# Altium project 车载定位器设计.PrjPcb
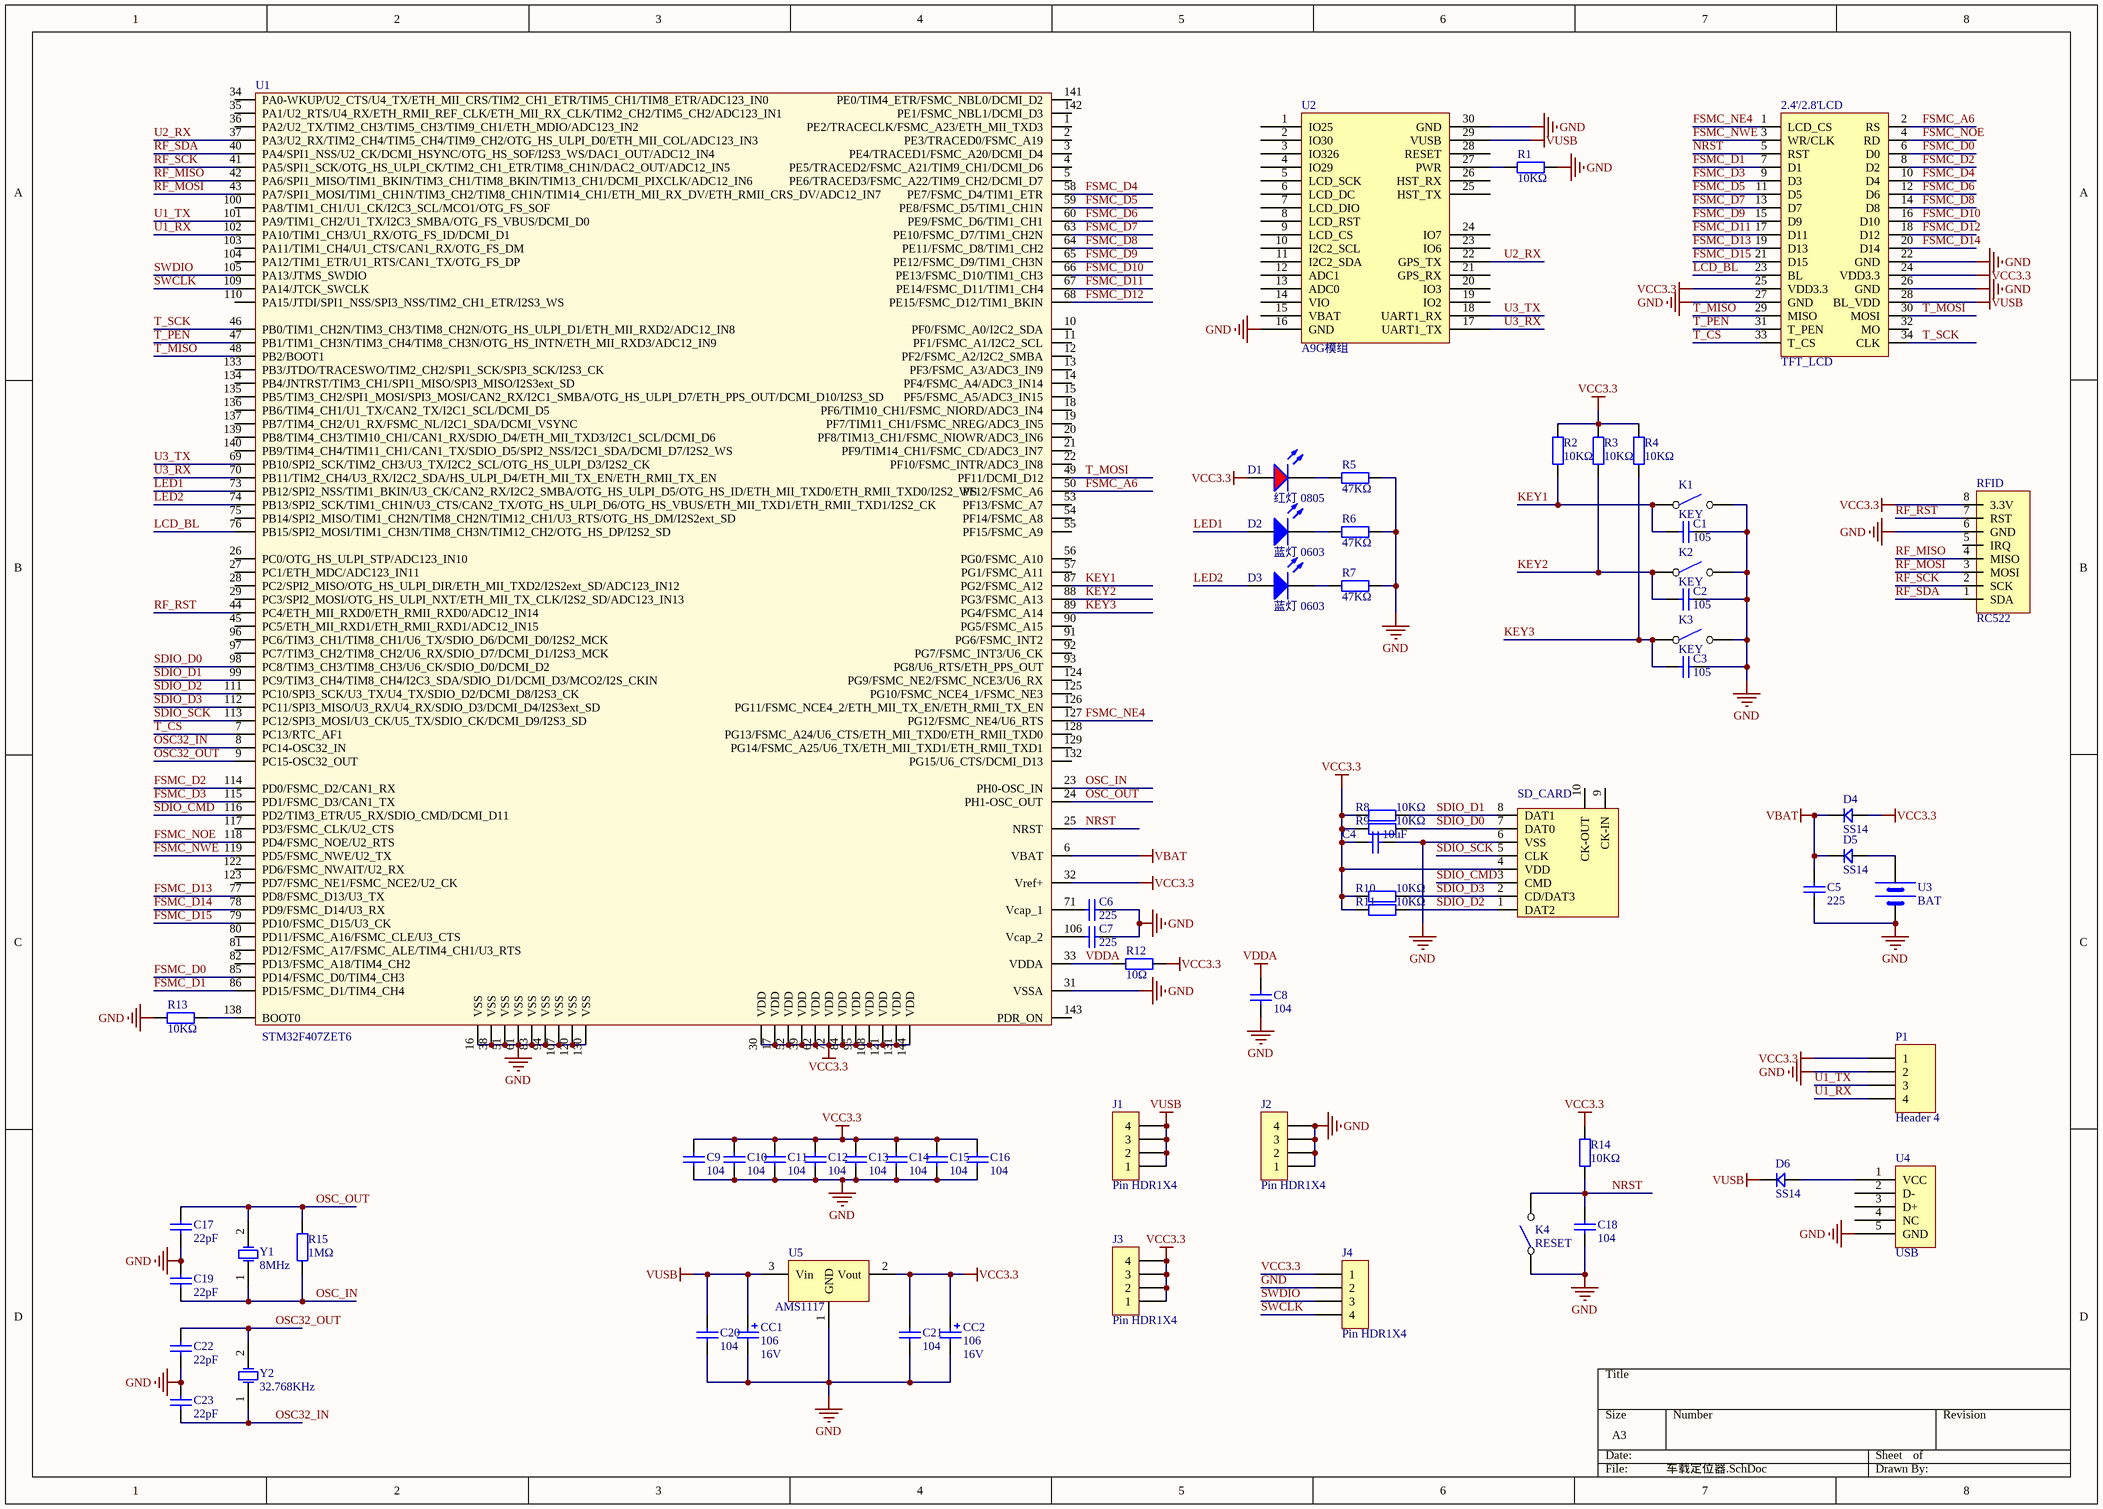
[diagram p0: 车载定位器.SchDoc]
1 sheet, 65 parts. Net scope: global (net labels, ports and power ports of the same name join across sheets).
Board file: 车载定位器.PcbDoc

## Sheet 车载定位器.SchDoc
size A3

### Parts
2.4'/2.8'LCD  TFT_LCD  [TFT_LCD2.8]
C1  105  [LC-0805_C]
C2  105  [LC-0805_C]
C3  105  [LC-0805_C]
C4  10uF  [LC-0805_C]
C5  225  [LC-0805_C]
C6  225  [LC-0805_C]
C7  225  [LC-0805_C]
C8  104  [LC-0805_C]
C9  104  [LC-0805_C]
C10  104  [LC-0805_C]
C11  104  [LC-0805_C]
C12  104  [LC-0805_C]
C13  104  [LC-0805_C]
C14  104  [LC-0805_C]
C15  104  [LC-0805_C]
C16  104  [LC-0805_C]
C17  22pF  [LC-0805_C]
C18  104  [LC-0805_C]
C19  22pF  [LC-0805_C]
C20  104  [LC-0805_C]
C21  104  [LC-0805_C]
C22  22pF  [LC-0805_C]
C23  22pF  [LC-0805_C]
CC1  Capacitance: 106  Voltage: 16V  [TAN-C-6032]  (hidden comment: Cap Tan C)
CC2  Capacitance: 106  Voltage: 16V  [TAN-C-6032]  (hidden comment: Cap Tan C)
D1  红灯 0805  [LC-0805_LED_S1]
D2  蓝灯 0603  [LC-0805_LED_S1]
D3  蓝灯 0603  [LC-0805_LED_S1]
D4  SS14  [LC-SOD-123]
D5  SS14  [LC-SOD-123]
D6  SS14  [LC-SOD-123]
J1  Pin HDR1X4  [Pin HDR1X4/2.54mm-S]
J2  Pin HDR1X4  [Pin HDR1X4/2.54mm-S]
J3  Pin HDR1X4  [Pin HDR1X4/2.54mm-S]
J4  Pin HDR1X4  [Pin HDR1X4/2.54mm-S]
K1  KEY  [KEY_2]
K2  KEY  [KEY_2]
K3  KEY  [KEY_2]
K4  RESET  [KEY_2]
P1  Header 4  [HDR1X4]
R1  10KΩ  [LC-0805_R]
R2  10KΩ  [LC-0805_R]
R3  10KΩ  [LC-0805_R]
R4  10KΩ  [LC-0805_R]
R5  47KΩ  [LC-0805_R]
R6  47KΩ  [LC-0805_R]
R7  47KΩ  [LC-0805_R]
R8  10KΩ  [LC-0805_R]
R9  10KΩ  [LC-0805_R]
R10  10KΩ  [LC-0805_R]
R11  10KΩ  [LC-0805_R]
R12  10Ω  [LC-0805_R]
R13  10KΩ  [LC-0805_R]
R14  10KΩ  [LC-0805_R]
R15  1MΩ  [LC-0805_R]
RFID  RC522  [RFID]
SD_CARD  sdIO-sdcard  [Micro SD]  (value not drawn)
U1  STM32F407ZET6  [LQFP144 20X20]
U2  A9G模组  [A9G]
U3  BAT  [CR1220_A]
U4  USB  [USB_B]
U5  AMS1117  [SOT-223]
Y1  8MHz  [XTAL-SMD]
Y2  32.768KHz  [OSC-3x8-WI-B]

### Nets
GND: 2.4'/2.8'LCD.22(GND) 2.4'/2.8'LCD.26(GND) 2.4'/2.8'LCD.27(GND) C1.2 C2.2 C3.2 C4.2 C5.1 C6.2 C7.2 C8.1 C9.1 C10.1 C11.1 C12.1 C13.1 C14.1 C15.1 C16.1 C17.1 C18.1 C19.2 C20.1 C21.1 C22.1 C23.2 CC1.1 CC2.1 J2.1 J2.2 J2.3 J2.4 J4.2 K1.2 K2.2 K3.2 K4.1 P1.2 R1.2 R5.2 R6.2 R7.2 R13.1 RFID.6(GND) SD_CARD.6(VSS) U1.16(VSS) U1.31(VSSA) U1.38(VSS) U1.51(VSS) U1.61(VSS) U1.83(VSS) U1.94(VSS) U1.107(VSS) U1.120(VSS) U1.130(VSS) U2.16(GND) U2.30(GND) U3.2(GND) U4.5(GND) U5.1(GND)
VBAT: C5.2 D4.2 D5.2 U1.6(VBAT)
VCC3.3: 2.4'/2.8'LCD.24(VDD3.3) 2.4'/2.8'LCD.25(VDD3.3) C4.1 C9.2 C10.2 C11.2 C12.2 C13.2 C14.2 C15.2 C16.2 C21.2 CC2.2 D1.A D4.1 J3.1 J3.2 J3.3 J3.4 J4.1 P1.1 R2.2 R3.2 R4.2 R8.1 R9.1 R10.1 R11.1 R12.2 R14.2 RFID.8(3.3V) SD_CARD.4(VDD) U1.17(VDD) U1.30(VDD) U1.32(Vref+) U1.39(VDD) U1.52(VDD) U1.62(VDD) U1.72(VDD) U1.84(VDD) U1.95(VDD) U1.108(VDD) U1.121(VDD) U1.131(VDD) U1.144(VDD) U5.2(Vout)
VDDA: C8.2 R12.1 U1.33(VDDA)
VUSB: 2.4'/2.8'LCD.28(BL_VDD) C20.2 CC1.2 D6.2 J1.1 J1.2 J1.3 J1.4 U2.29(VUSB) U5.3(Vin)
FSMC_A6: 2.4'/2.8'LCD.2(RS) U1.50(PF12/FSMC_A6)
FSMC_D0: 2.4'/2.8'LCD.6(D0) U1.85(PD14/FSMC_D0/TIM4_CH3)
FSMC_D1: 2.4'/2.8'LCD.7(D1) U1.86(PD15/FSMC_D1/TIM4_CH4)
FSMC_D2: 2.4'/2.8'LCD.8(D2) U1.114(PD0/FSMC_D2/CAN1_RX)
FSMC_D3: 2.4'/2.8'LCD.9(D3) U1.115(PD1/FSMC_D3/CAN1_TX)
FSMC_D4: 2.4'/2.8'LCD.10(D4) U1.58(PE7/FSMC_D4/TIM1_ETR)
FSMC_D5: 2.4'/2.8'LCD.11(D5) U1.59(PE8/FSMC_D5/TIM1_CH1N)
FSMC_D6: 2.4'/2.8'LCD.12(D6) U1.60(PE9/FSMC_D6/TIM1_CH1)
FSMC_D7: 2.4'/2.8'LCD.13(D7) U1.63(PE10/FSMC_D7/TIM1_CH2N)
FSMC_D8: 2.4'/2.8'LCD.14(D8) U1.64(PE11/FSMC_D8/TIM1_CH2)
FSMC_D9: 2.4'/2.8'LCD.15(D9) U1.65(PE12/FSMC_D9/TIM1_CH3N)
FSMC_D10: 2.4'/2.8'LCD.16(D10) U1.66(PE13/FSMC_D10/TIM1_CH3)
FSMC_D11: 2.4'/2.8'LCD.17(D11) U1.67(PE14/FSMC_D11/TIM1_CH4)
FSMC_D12: 2.4'/2.8'LCD.18(D12) U1.68(PE15/FSMC_D12/TIM1_BKIN)
FSMC_D13: 2.4'/2.8'LCD.19(D13) U1.77(PD8/FSMC_D13/U3_TX)
FSMC_D14: 2.4'/2.8'LCD.20(D14) U1.78(PD9/FSMC_D14/U3_RX)
FSMC_D15: 2.4'/2.8'LCD.21(D15) U1.79(PD10/FSMC_D15/U3_CK)
FSMC_NE4: 2.4'/2.8'LCD.1(LCD_CS) U1.127(PG12/FSMC_NE4/U6_RTS)
FSMC_NOE: 2.4'/2.8'LCD.4(RD) U1.118(PD4/FSMC_NOE/U2_RTS)
FSMC_NWE: 2.4'/2.8'LCD.3(WR/CLK) U1.119(PD5/FSMC_NWE/U2_TX)
KEY1: C1.1 K1.1 R2.1 U1.87(PG2/FSMC_A12)
KEY2: C2.1 K2.1 R3.1 U1.88(PG3/FSMC_A13)
KEY3: C3.1 K3.1 R4.1 U1.89(PG4/FSMC_A14)
LCD_BL: 2.4'/2.8'LCD.23(BL) U1.76(PB15/SPI2_MOSI/TIM1_CH3N/TIM8_CH3N/TIM12_CH2/OTG_HS_DP/I2S2_SD)
LED1: D2.A U1.73(PB12/SPI2_NSS/TIM1_BKIN/U3_CK/CAN2_RX/I2C2_SMBA/OTG_HS_ULPI_D5/OTG_HS_ID/ETH_MII_TXD0/ETH_RMII_TXD0/I2S2_WS)
LED2: D3.A U1.74(PB13/SPI2_SCK/TIM1_CH1N/U3_CTS/CAN2_TX/OTG_HS_ULPI_D6/OTG_HS_VBUS/ETH_MII_TXD1/ETH_RMII_TXD1/I2S2_CK)
NRST: 2.4'/2.8'LCD.5(RST) C18.2 K4.2 R14.1 U1.25(NRST)
OSC32_IN: C23.1 U1.8(PC14-OSC32_IN) Y2.1(OSC1)
OSC32_OUT: C22.2 U1.9(PC15-OSC32_OUT) Y2.2(OSC2)
OSC_IN: C19.1 R15.1 U1.23(PH0-OSC_IN) Y1.1(OSC1)
OSC_OUT: C17.2 R15.2 U1.24(PH1-OSC_OUT) Y1.2(OSC2)
RF_MISO: RFID.4(MISO) U1.42(PA6/SPI1_MISO/TIM1_BKIN/TIM3_CH1/TIM8_BKIN/TIM13_CH1/DCMI_PIXCLK/ADC12_IN6)
RF_MOSI: RFID.3(MOSI) U1.43(PA7/SPI1_MOSI/TIM1_CH1N/TIM3_CH2/TIM8_CH1N/TIM14_CH1/ETH_MII_RX_DV/ETH_RMII_CRS_DV/ADC12_IN7)
RF_RST: RFID.7(RST) U1.44(PC4/ETH_MII_RXD0/ETH_RMII_RXD0/ADC12_IN14)
RF_SCK: RFID.2(SCK) U1.41(PA5/SPI1_SCK/OTG_HS_ULPI_CK/TIM2_CH1_ETR/TIM8_CH1N/DAC2_OUT/ADC12_IN5)
RF_SDA: RFID.1(SDA) U1.40(PA4/SPI1_NSS/U2_CK/DCMI_HSYNC/OTG_HS_SOF/I2S3_WS/DAC1_OUT/ADC12_IN4)
SDIO_CMD: SD_CARD.3(CMD) U1.116(PD2/TIM3_ETR/U5_RX/SDIO_CMD/DCMI_D11)
SDIO_D0: R9.2 SD_CARD.7(DAT0) U1.98(PC8/TIM3_CH3/TIM8_CH3/U6_CK/SDIO_D0/DCMI_D2)
SDIO_D1: R8.2 SD_CARD.8(DAT1) U1.99(PC9/TIM3_CH4/TIM8_CH4/I2C3_SDA/SDIO_D1/DCMI_D3/MCO2/I2S_CKIN)
SDIO_D2: R11.2 SD_CARD.1(DAT2) U1.111(PC10/SPI3_SCK/U3_TX/U4_TX/SDIO_D2/DCMI_D8/I2S3_CK)
SDIO_D3: R10.2 SD_CARD.2(CD/DAT3) U1.112(PC11/SPI3_MISO/U3_RX/U4_RX/SDIO_D3/DCMI_D4/I2S3ext_SD)
SDIO_SCK: SD_CARD.5(CLK) U1.113(PC12/SPI3_MOSI/U3_CK/U5_TX/SDIO_CK/DCMI_D9/I2S3_SD)
SWCLK: J4.4 U1.109(PA14/JTCK_SWCLK)
SWDIO: J4.3 U1.105(PA13/JTMS_SWDIO)
T_CS: 2.4'/2.8'LCD.33(T_CS) U1.7(PC13/RTC_AF1)
T_MISO: 2.4'/2.8'LCD.29(MISO) U1.48(PB2/BOOT1)
T_MOSI: 2.4'/2.8'LCD.30(MOSI) U1.49(PF11/DCMI_D12)
T_PEN: 2.4'/2.8'LCD.31(T_PEN) U1.47(PB1/TIM1_CH3N/TIM3_CH4/TIM8_CH3N/OTG_HS_INTN/ETH_MII_RXD3/ADC12_IN9)
T_SCK: 2.4'/2.8'LCD.34(CLK) U1.46(PB0/TIM1_CH2N/TIM3_CH3/TIM8_CH2N/OTG_HS_ULPI_D1/ETH_MII_RXD2/ADC12_IN8)
U1_RX: P1.4 U1.102(PA10/TIM1_CH3/U1_RX/OTG_FS_ID/DCMI_D1)
U1_TX: P1.3 U1.101(PA9/TIM1_CH2/U1_TX/I2C3_SMBA/OTG_FS_VBUS/DCMI_D0)
U2_RX: U1.37(PA3/U2_RX/TIM2_CH4/TIM5_CH4/TIM9_CH2/OTG_HS_ULPI_D0/ETH_MII_COL/ADC123_IN3) U2.22(GPS_TX)
U3_RX: U1.70(PB11/TIM2_CH4/U3_RX/I2C2_SDA/HS_ULPI_D4/ETH_MII_TX_EN/ETH_RMII_TX_EN) U2.17(UART1_TX)
U3_TX: U1.69(PB10/SPI2_SCK/TIM2_CH3/U3_TX/I2C2_SCL/OTG_HS_ULPI_D3/I2S2_CK) U2.18(UART1_RX)
NetC6_1: C6.1 U1.71(Vcap_1)
NetC7_1: C7.1 U1.106(Vcap_2)
NetD1_K: D1.K R5.1
NetD2_K: D2.K R6.1
NetD3_K: D3.K R7.1
NetD5_1: D5.1 U3.1(VCC)
NetD6_1: D6.1 U4.1(VCC)
NetR1_1: R1.1 U2.27(PWR)
NetR13_2: R13.2 U1.138(BOOT0)

Not connected (* = marked no-connect by the designer): 2.4'/2.8'LCD 32(MO); RFID 5(IRQ); SD_CARD 9(CK-IN) 10(CK-OUT); U1 1(PE2/TRACECLK/FSMC_A23/ETH_MII_TXD3) 2(PE3/TRACED0/FSMC_A19) 3(PE4/TRACED1/FSMC_A20/DCMI_D4) 4(PE5/TRACED2/FSMC_A21/TIM9_CH1/DCMI_D6) 5(PE6/TRACED3/FSMC_A22/TIM9_CH2/DCMI_D7) 10(PF0/FSMC_A0/I2C2_SDA) 11(PF1/FSMC_A1/I2C2_SCL) 12(PF2/FSMC_A2/I2C2_SMBA) 13(PF3/FSMC_A3/ADC3_IN9) 14(PF4/FSMC_A4/ADC3_IN14) 15(PF5/FSMC_A5/ADC3_IN15) 18(PF6/TIM10_CH1/FSMC_NIORD/ADC3_IN4) 19(PF7/TIM11_CH1/FSMC_NREG/ADC3_IN5) 20(PF8/TIM13_CH1/FSMC_NIOWR/ADC3_IN6) 21(PF9/TIM14_CH1/FSMC_CD/ADC3_IN7) 22(PF10/FSMC_INTR/ADC3_IN8) 26(PC0/OTG_HS_ULPI_STP/ADC123_IN10) 27(PC1/ETH_MDC/ADC123_IN11) 28(PC2/SPI2_MISO/OTG_HS_ULPI_DIR/ETH_MII_TXD2/I2S2ext_SD/ADC123_IN12) 29(PC3/SPI2_MOSI/OTG_HS_ULPI_NXT/ETH_MII_TX_CLK/I2S2_SD/ADC123_IN13) 34(PA0-WKUP/U2_CTS/U4_TX/ETH_MII_CRS/TIM2_CH1_ETR/TIM5_CH1/TIM8_ETR/ADC123_IN0) 35(PA1/U2_RTS/U4_RX/ETH_RMII_REF_CLK/ETH_MII_RX_CLK/TIM2_CH2/TIM5_CH2/ADC123_IN1) 36(PA2/U2_TX/TIM2_CH3/TIM5_CH3/TIM9_CH1/ETH_MDIO/ADC123_IN2) 45(PC5/ETH_MII_RXD1/ETH_RMII_RXD1/ADC12_IN15) 53(PF13/FSMC_A7) 54(PF14/FSMC_A8) 55(PF15/FSMC_A9) 56(PG0/FSMC_A10) 57(PG1/FSMC_A11) 75(PB14/SPI2_MISO/TIM1_CH2N/TIM8_CH2N/TIM12_CH1/U3_RTS/OTG_HS_DM/I2S2ext_SD) 80(PD11/FSMC_A16/FSMC_CLE/U3_CTS) 81(PD12/FSMC_A17/FSMC_ALE/TIM4_CH1/U3_RTS) 82(PD13/FSMC_A18/TIM4_CH2) 90(PG5/FSMC_A15) 91(PG6/FSMC_INT2) 92(PG7/FSMC_INT3/U6_CK) 93(PG8/U6_RTS/ETH_PPS_OUT) 96(PC6/TIM3_CH1/TIM8_CH1/U6_TX/SDIO_D6/DCMI_D0/I2S2_MCK) 97(PC7/TIM3_CH2/TIM8_CH2/U6_RX/SDIO_D7/DCMI_D1/I2S3_MCK) 100(PA8/TIM1_CH1/U1_CK/I2C3_SCL/MCO1/OTG_FS_SOF) 103(PA11/TIM1_CH4/U1_CTS/CAN1_RX/OTG_FS_DM) 104(PA12/TIM1_ETR/U1_RTS/CAN1_TX/OTG_FS_DP) 110(PA15/JTDI/SPI1_NSS/SPI3_NSS/TIM2_CH1_ETR/I2S3_WS) 117(PD3/FSMC_CLK/U2_CTS) 122(PD6/FSMC_NWAIT/U2_RX) 123(PD7/FSMC_NE1/FSMC_NCE2/U2_CK) 124(PG9/FSMC_NE2/FSMC_NCE3/U6_RX) 125(PG10/FSMC_NCE4_1/FSMC_NE3) 126(PG11/FSMC_NCE4_2/ETH_MII_TX_EN/ETH_RMII_TX_EN) 128(PG13/FSMC_A24/U6_CTS/ETH_MII_TXD0/ETH_RMII_TXD0) 129(PG14/FSMC_A25/U6_TX/ETH_MII_TXD1/ETH_RMII_TXD1) 132(PG15/U6_CTS/DCMI_D13) 133(PB3/JTDO/TRACESWO/TIM2_CH2/SPI1_SCK/SPI3_SCK/I2S3_CK) 134(PB4/JNTRST/TIM3_CH1/SPI1_MISO/SPI3_MISO/I2S3ext_SD) 135(PB5/TIM3_CH2/SPI1_MOSI/SPI3_MOSI/CAN2_RX/I2C1_SMBA/OTG_HS_ULPI_D7/ETH_PPS_OUT/DCMI_D10/I2S3_SD) 136(PB6/TIM4_CH1/U1_TX/CAN2_TX/I2C1_SCL/DCMI_D5) 137(PB7/TIM4_CH2/U1_RX/FSMC_NL/I2C1_SDA/DCMI_VSYNC) 139(PB8/TIM4_CH3/TIM10_CH1/CAN1_RX/SDIO_D4/ETH_MII_TXD3/I2C1_SCL/DCMI_D6) 140(PB9/TIM4_CH4/TIM11_CH1/CAN1_TX/SDIO_D5/SPI2_NSS/I2C1_SDA/DCMI_D7/I2S2_WS) 141(PE0/TIM4_ETR/FSMC_NBL0/DCMI_D2) 142(PE1/FSMC_NBL1/DCMI_D3) 143(PDR_ON); U2 1(IO25) 2(IO30) 3(IO326) 4(IO29) 5(LCD_SCK) 6(LCD_DC) 7(LCD_DIO) 8(LCD_RST) 9(LCD_CS) 10(I2C2_SCL) 11(I2C2_SDA) 12(ADC1) 13(ADC0) 14(VIO) 15(VBAT) 19(IO2) 20(IO3) 21(GPS_RX) 23(IO6) 24(IO7) 25(HST_TX) 26(HST_RX) 28(RESET); U4 2(D-) 3(D+) 4(NC)

### Library data of the parts
C1-C3 C5-C7 C9-C16 C20 C21 = 0805 6.8nF (682) 10% 50V: 贴片电容; ComponentLink1Description: 供应商链接; ComponentLink1URL: http://www.szlcsc.com/product/details_2107.html; Package: 0805; Supplier: LC; SuppliersPartNumber: C1755
C4 = 0805 10uF (106) 10% 25V: 贴片电容; ComponentLink1Description: 供应商链接; ComponentLink1URL: http://www.szlcsc.com/product/details_16532.html; Package: 0805; Supplier: LC; SuppliersPartNumber: C15850
C8 C18 = 0805 330nF (334) 10% 50V: 贴片电容; ComponentLink1Description: 供应商链接; ComponentLink1URL: http://www.szlcsc.com/product/details_2092.html; Package: 0805; Supplier: LC; SuppliersPartNumber: C1740
C17 C19 C22 C23 = 0805 6pF (6R0) 0.25pF 50V: 贴片电容; ComponentLink1Description: 供应商链接; ComponentLink1URL: http://www.szlcsc.com/product/details_68656.html; Package: 0805; Supplier: LC; SuppliersPartNumber: C67560
CC1 CC2 = Cap Tan C: Polarized Capacitor (Radial); Published: 8-Jun-2000; Revision: July-2002: Re-released for DXP Platform.; Publisher: Altium Limited
D1 = 0805 红灯: 发光二极管; ComponentLink1Description: 供应商链接; ComponentLink1URL: http://www.szlcsc.com/product/details_2668.html; Package: 0805; Supplier: LC; SuppliersPartNumber: C2295
D2 D3 = 0603 蓝灯: 发光二极管; ComponentLink1Description: 供应商链接; ComponentLink1URL: http://www.szlcsc.com/product/details_73150.html; Package: 0603; Supplier: LC; SuppliersPartNumber: C72041
D4-D6 = D
K1-K4 = KEY: 微动开关
P1 = Header 4: Header, 4-Pin; LatestRevisionDate: 17-Jul-2002; LatestRevisionNote: Re-released for DXP Platform.; Publisher: Altium Limited
R1 = 0805 10KΩ (1002) 1%: 贴片电阻; ComponentLink1Description: 供应商链接; ComponentLink1URL: http://www.szlcsc.com/product/details_18102.html; Package: 0805; Supplier: LC; SuppliersPartNumber: C17414
R2-R11 = 0805 11KΩ (1102) 1%: 贴片电阻; ComponentLink1Description: 供应商链接; ComponentLink1URL: http://www.szlcsc.com/product/details_18117.html; Package: 0805; Supplier: LC; SuppliersPartNumber: C17429
R12 R13 = 0805 9.1KΩ (9101) 1%: 贴片电阻; ComponentLink1Description: 供应商链接; ComponentLink1URL: http://www.szlcsc.com/product/details_18543.html; Package: 0805; Supplier: LC; SuppliersPartNumber: C17855
R14 R15 = 0805 390KΩ (3903) 1%: 贴片电阻; ComponentLink1Description: 供应商链接; ComponentLink1URL: http://www.szlcsc.com/product/details_18344.html; Package: 0805; Supplier: LC; SuppliersPartNumber: C17656
RFID = RFID
U3 = BAT: 纽扣电池座CR1220
U5 = AMS1117: 3.3V电压转换器AMS1117
Y1 Y2 = XTAL: 晶体振荡器; Published: 8-Jun-2000; LatestRevisionDate: 17-Jul-2002; LatestRevisionNote: Re-released for DXP Platform.; PackageReference: R38; Publisher: Altium Limited